# EasyEDA Pro project Lamp Gcse Main Control board V0.3.epro

# Schematic Schematic1_2

## Sheets
1 P1: Board Name: Board2_1; Create Date: 2025-11-16; Page Name: P1; Project Name: GCSE LAMP PCBs; Schematic Name: Schematic1_2; Update Date: 2025-11-16; Company: EasyEDA.com; Page Size: A4; Version: V1.0
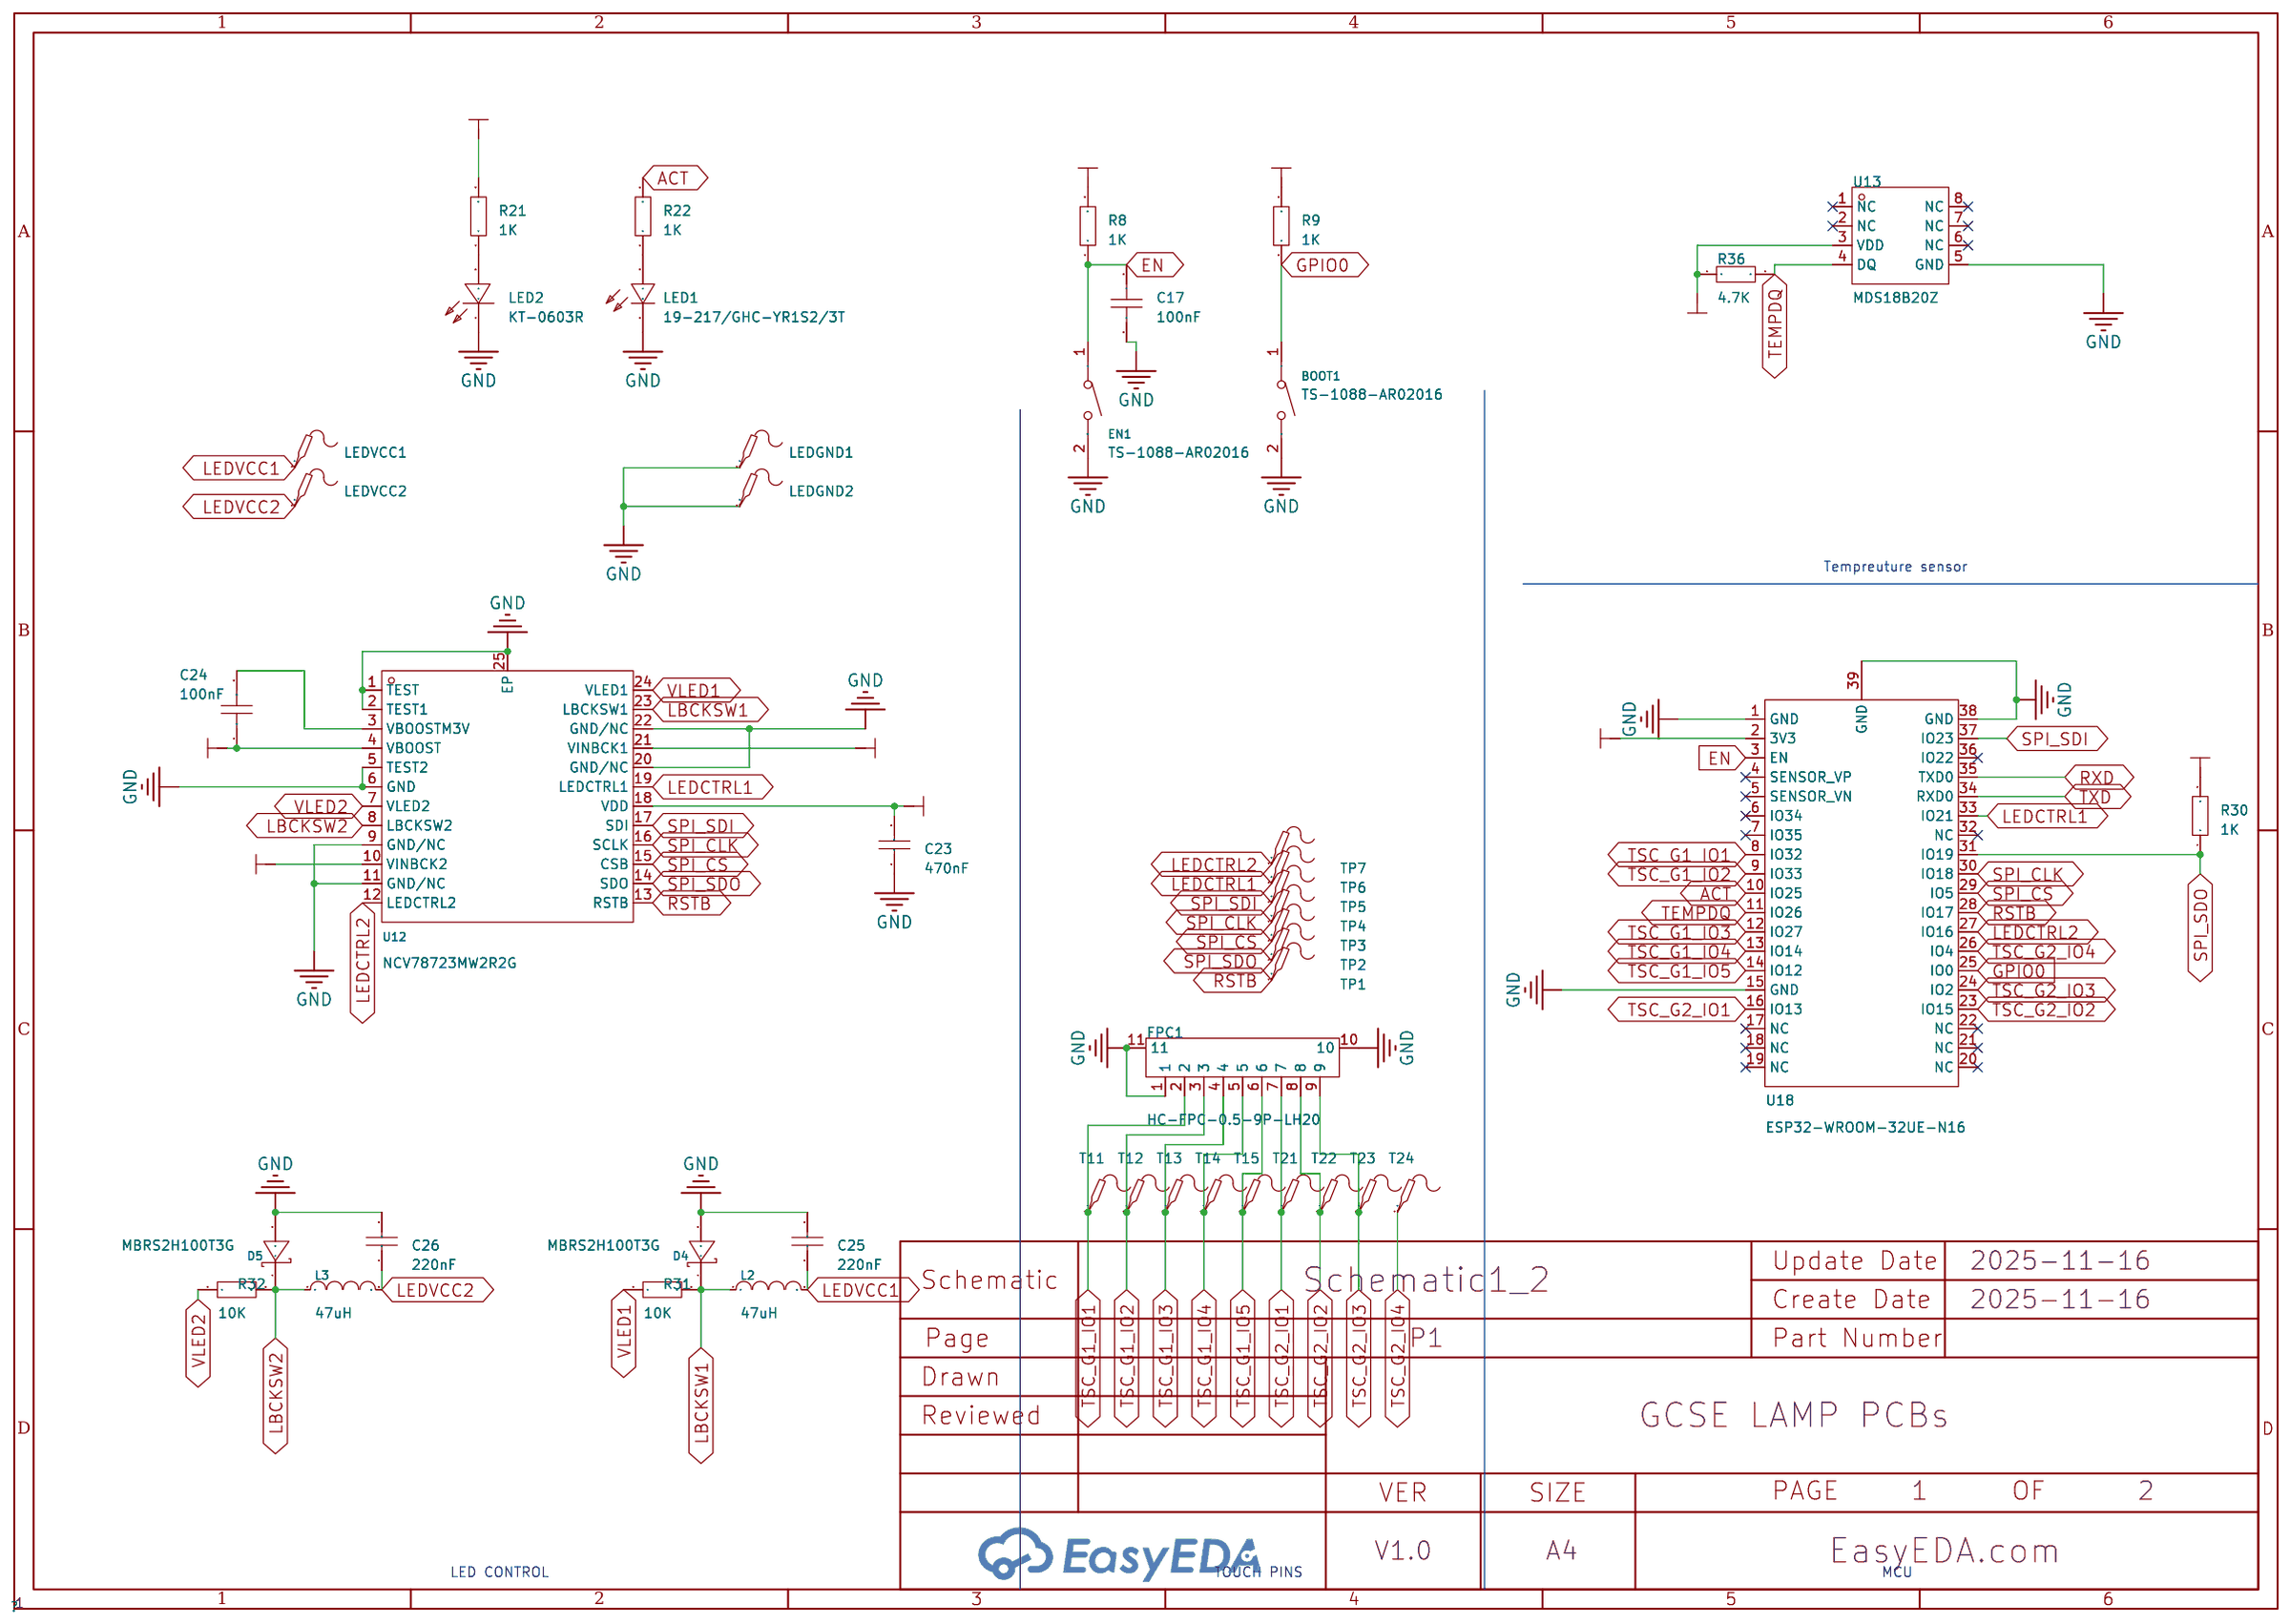
[diagram p0: P1]
2 P2: Page Name: P2; Update Date: 2025-11-18
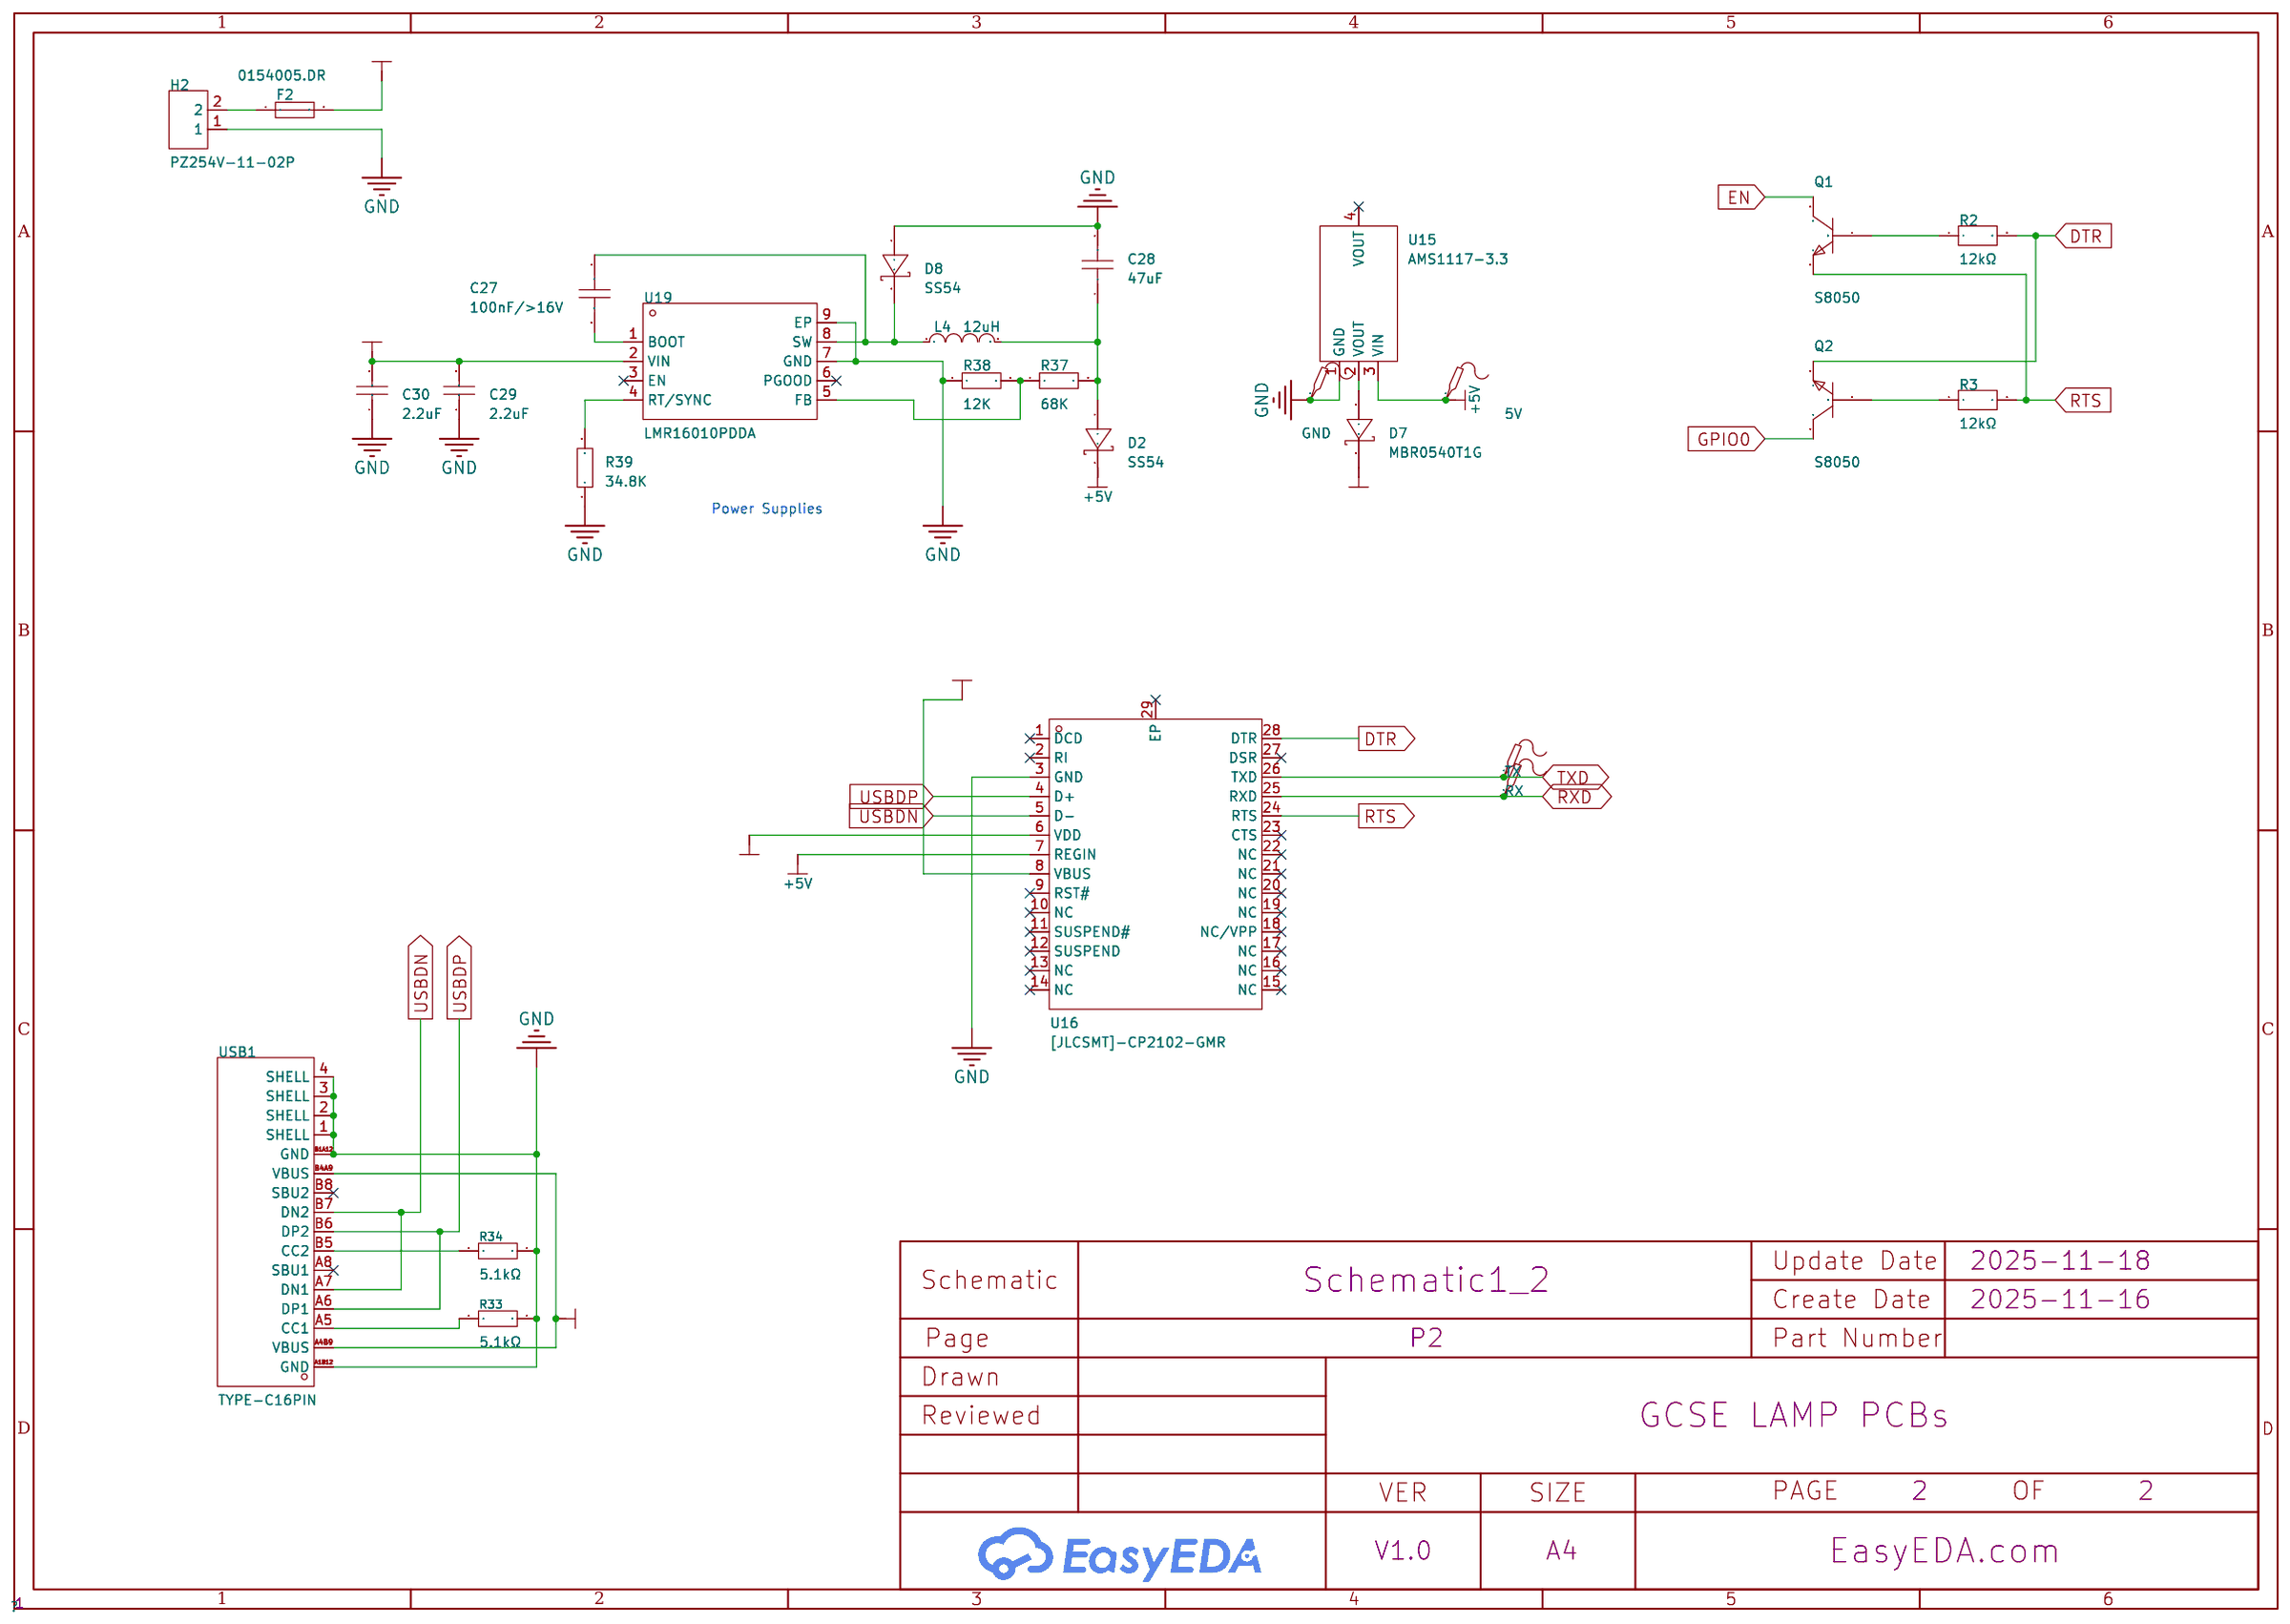
[diagram p1: P2]

## Parts
sheet P1
BOOT1  TS-1088-AR02016  [SW-SMD_L3.9-W3.0-P4.45]
C17  100nF  [C0603]
C23  470nF  [C0603]
C24  100nF  [C0805]
C25  220nF  [C0603]
C26  220nF  [C0603]
D4  MBRS2H100T3G  [SMB_L4.6-W3.6-LS5.3-RD]
D5  MBRS2H100T3G  [SMB_L4.6-W3.6-LS5.3-RD]
EN1  TS-1088-AR02016  [SW-SMD_L3.9-W3.0-P4.45]
FPC1  HC-FPC-0.5-9P-LH20  [FPC-SMD_9P-P0.50_HC-FPC-0.5-9P-LH20]
L2  47uH  [IND-SMD_L11.5-W10.0_SMMS1040]
L3  47uH  [IND-SMD_L11.5-W10.0_SMMS1040]
LED1  19-217/GHC-YR1S2/3T  [LED0603-RD]
LED2  KT-0603R  [LED0603-RD]
LEDGND1  -  [Test-Point-0.5mm]
LEDGND2  -  [Test-Point-0.5mm]
LEDVCC1  -  [Test-Point-0.5mm]
LEDVCC2  -  [Test-Point-0.5mm]
R8  1K  [R0603]
R9  1K  [R0603]
R21  1K  [R0603]
R22  1K  [R0603]
R30  1K  [R0603]
R31  10K  [R0603]
R32  10K  [R0603]
R36  4.7K  [R0603]
T11  -  [Test-Point-0.5mm]
T12  -  [Test-Point-0.5mm]
T13  -  [Test-Point-0.5mm]
T14  -  [Test-Point-0.5mm]
T15  -  [Test-Point-0.5mm]
T21  -  [Test-Point-0.5mm]
T22  -  [Test-Point-0.5mm]
T23  -  [Test-Point-0.5mm]
T24  -  [Test-Point-0.5mm]
TP1  -  [Test-Point-0.5mm]
TP2  -  [Test-Point-0.5mm]
TP3  -  [Test-Point-0.5mm]
TP4  -  [Test-Point-0.5mm]
TP5  -  [Test-Point-0.5mm]
TP6  -  [Test-Point-0.5mm]
TP7  -  [Test-Point-0.5mm]
U12  NCV78723MW2R2G  [QFN-24_L5.0-W5.0-P0.65-TL-EP3.5]
U13  MDS18B20Z  [SOIC-8_L4.9-W3.9-P1.27-LS6.0-BL]
U18  ESP32-WROOM-32UE-N16  [COMM-SMD_ESP32-WROOM-32UE-N16]
sheet P2
5V  -  [Test-Point-0.5mm]
C27  100nF/>16V  [C0603]
C28  47uF  [C1210]
C29  2.2uF  [C1210]
C30  2.2uF  [C1210]
D2  SS54  [SMA_L4.4-W2.8-LS5.4-R-RD]
D7  MBR0540T1G  [SOD-123_L2.8-W1.8-LS3.7-RD]
D8  SS54  [SMA_L4.4-W2.8-LS5.4-R-RD]
F2  0154005.DR  [FUSE-SMD_L9.8-W5.1]
GND  -  [Test-Point-0.5mm]
H2  PZ254V-11-02P  [HDR-TH_2P-P2.54-V-M]
L4  12uH  [IND-SMD_L4.0-W4.0_FNR40XXS]
Q1  S8050  [SOT-23-3_L2.9-W1.3-P1.90-LS2.4-BR]
Q2  S8050  [SOT-23-3_L2.9-W1.3-P1.90-LS2.4-BR]
R2  12kΩ  [R0603]
R3  12kΩ  [R0603]
R33  5.1kΩ  [R0603]
R34  5.1kΩ  [R0603]
R37  68K  [R0603]
R38  12K  [R0603]
R39  34.8K  [R0603]
RX  -  [Test-Point-0.5mm]
TX  -  [Test-Point-0.5mm]
U15  AMS1117-3.3  [SOT-223-3_L6.5-W3.4-P2.30-LS7.0-BR]
U16  [JLCSMT]-CP2102-GMR  [QFN-28_L5.0-W5.0-P0.50-BL-EP3.15]
U19  LMR16010PDDA  [SO-8_L4.9-W3.9-P1.27-LS6.0-BL-EP]
USB1  TYPE-C16PIN  [USB-C-SMD_TYPE-C16PIN]

## Library data of the parts
BOOT1 EN1 = TS-1088-AR02016: Circuit:SPST Actuator Style:Round Button Operating Force:160gf Mounting Style:Brick nogging Switch Length:4mm Switch Width:3mm Switch Height:2mm Strike Gundam:不带 Contact Current:50mA Voltage Rating (DC):12V Insulation Resistance:100MΩ Actuator/Cap Color:B; LCSC Part Name: 4*3*2mm 立贴 轻触开关; Supplier Part: C720477; Manufacturer: XUNPU(讯普); Supplier Footprint: SMD; JLCPCB Part Class: Extended Part; Datasheet: https://atta.szlcsc.com/upload/public/pdf/source/20200810/C720475_60D09DD6C54279ADDB2DC25100F1CC11.pdf; Supplier: LCSC; Circuit: SPST; Actuator Style: Round Button; Operating Force: 160gf; Mounting Style: Brick nogging; Switch Length: 4mm; Switch Width: 3mm; Switch Height: 2mm; Strike Gundam: 不带; Contact Current: 50mA; Voltage Rating (DC): 12V; Insulation Resistance: 100MΩ; Actuator/Cap Color: Black; Pin Style: SMDSplicing; Mechanical Life: 10万次; Operating Temperature: -30℃~+80℃
C17 = GMC10X7R104K50NT: Capacitance:0.1uF Tolerance:±10% Tolerance:±10% Voltage Rating:50V Temperature Coefficient:X7R; LCSC Part Name: 100nF ±10% 50V; Supplier Part: C17669921; Manufacturer: CAL-CHIP; Supplier Footprint: 0603; JLCPCB Part Class: 扩展库; Datasheet: https://atta.szlcsc.com/upload/public/pdf/source/231023/C17227280-d034107a430199d086d7de5e47b32198.pdf; Supplier: LCSC; Tolerance: ±10%; Voltage Rating: 50V; Temperature Coefficient: X7R
C23 = CL10B474KA8NNNC: Capacitance: Tolerance:±10% Tolerance:±10% Voltage Rated: Temperature Coefficient:; LCSC Part Name: 470nF ±10% 25V; Supplier Part: C1623; Manufacturer: SAMSUNG(三星); Supplier Footprint: 0603; JLCPCB Part Class: Basic Part; Datasheet: https://atta.szlcsc.com/upload/public/pdf/source/20160218/1457707763339.pdf; Supplier: LCSC; Tolerance: ±10%
C24 = CC0805KRX7R9BB104: Capacitance: Tolerance:±10% Tolerance:±10% Voltage Rated: Temperature Coefficient:; LCSC Part Name: 100nF ±10% 50V; Supplier Part: C49678; Manufacturer: YAGEO(国巨); Supplier Footprint: 0805; JLCPCB Part Class: 基础库; Datasheet: https://atta.szlcsc.com/upload/public/pdf/source/20180224/C181747_15194369449651363981.pdf; Supplier: LCSC; Tolerance: ±10%
C25 C26 = CL10B224KB8NNNC: Capacitance: Tolerance:±10% Tolerance:±10% Voltage Rated: Temperature Coefficient:; LCSC Part Name: 220nF ±10% 50V; Supplier Part: C64705; Manufacturer: SAMSUNG(三星); Supplier Footprint: 0603; JLCPCB Part Class: Extended Part; Datasheet: https://atta.szlcsc.com/upload/public/pdf/source/20160218/1457707763339.pdf; Supplier: LCSC; Tolerance: ±10%
D4 D5 = MBRS2H100T3G: Forward Voltage (Vf@If):790mV@2A Reverse Voltage (Vr):100V Average Rectified Current (Io):2A Reverse Leakage Current (Ir):8uA@100V; LCSC Part Name: 电压:100V 电流:2A; Supplier Part: C83299; Manufacturer: onsemi(安森美); Supplier Footprint: SMB(DO-214AA); JLCPCB Part Class: 扩展库; Datasheet: https://atta.szlcsc.com/upload/public/pdf/source/20180112/C153778_15157258148341261644.PDF; Supplier: LCSC; Forward Voltage (Vf@If): 790mV@2A; Reverse Voltage (Vr): 100V; Average Rectified Current (Io): 2A; Reverse Leakage Current (Ir): 8uA@100V
FPC1 = HC-FPC-0.5-9P-LH20: Locking Feature:Slide Lock Contact Type:Single-side Contact/Vertical Number of Contacts:9P Pitch:0.5mm Mounting Type:Surface Mount,Vertical FFC, FCB Thickness:0.3mm FFC, FCB Thickness:0.3mm Height Above Board:4.5mm Contact Material:- Contact Plating:- Ope; LCSC Part Name: 抽屉式 单侧触点/垂直 P数:9P 间距:0.5mm; Supplier Part: C49166890; Manufacturer: HC(虹成电子); Supplier Footprint: SMD,P=0.5mm(交错脚); JLCPCB Part Class: Extended Part; Datasheet: https://atta.szlcsc.com/upload/public/pdf/source/20250613/82F48CADE1F9CB45E74CB3AE3886D5BC.pdf; Supplier: LCSC; Locking Feature: Slide Lock; Contact Type: Single-side Contact/Vertical; Number of Contacts: 9P; Pitch: 0.5mm; Mounting Type: Surface Mount,Vertical; FFC, FCB Thickness: 0.3mm; Height Above Board: 4.5mm; Operating Temperature: -25℃~+85℃
L2 L3 = SMMS1040-470M: Inductance: Tolerance:±20% Tolerance:±20% Rated Current: Saturation Current (Isat):4.5A DC Resistance (DCR): Type:一体成型电感; LCSC Part Name: 47uH ±20% 4.5A; Supplier Part: C149599; Manufacturer: SXN(顺翔诺); JLCPCB Part Class: 扩展库; Datasheet: https://atta.szlcsc.com/upload/public/pdf/source/20210810/BBF24330FB2F5029F637830BA9C42C0D.pdf; Supplier: LCSC; Tolerance: ±20%; Saturation Current (Isat): 4.5A; Type: 一体成型电感
LED1 = 19-217/GHC-YR1S2/3T: Illumination Color:Emerald Green Voltage - Forward(Vf):3.3V Voltage - Forward(Vf):3.3V Power(Watts):110mW Forward Current:20mA Wavelength - Dominant:520nm~535nm Wavelength - Dominant:520nm~535nm Peak Wavelength:518nm Diode Configuration:- Lens Color:Water; LCSC Part Name: 翠绿 停产; Supplier Part: C72043; Manufacturer: EVERLIGHT(亿光); Supplier Footprint: 0603; JLCPCB Part Class: Extended Part; Supplier: LCSC; Illumination Color: Emerald Green; Voltage - Forward(Vf): 3.3V; Power(Watts): 110mW; Forward Current: 20mA; Wavelength - Dominant: 520nm~535nm; Peak Wavelength: 518nm; Lens Color: Water Clear; Luminous Intensity: 199mcd; Viewing Angle: 120°; Operating Temperature: -40℃~+85℃
LED2 = KT-0603R: Emitted Color:Red Power Dissipation:- Forward Current:- Dominant Wavelength:- Dominant Wavelength:- Peak Wavelength:- Diode Configuration:- Lens Color:- Color Temperature:- Color Temperature:- Viewing Angle:- Mounting Sytle:- Operating Temperature:-40℃~+8; LCSC Part Name: 0603 红灯 高亮; Supplier Part: C2286; Manufacturer: KENTO; Supplier Footprint: 0603; JLCPCB Part Class: 基础库; Datasheet: https://atta.szlcsc.com/upload/public/pdf/source/20160616/1466072038404.pdf; Supplier: LCSC; Emitted Color: Red; Operating Temperature: -40℃~+85℃
5V GND LEDGND1 LEDGND2 LEDVCC1 LEDVCC2 RX T11-T15 T21-T24 TP1-TP7 TX = Test-Point: Test Point 测试点
R8 R9 R21 R22 R30-R32 R36-R39 = Res_0603: Supplier Footprint: 0603
U12 = NCV78723MW2R2G: Supplier Part: C895782; Manufacturer: onsemi(安森美); Supplier Footprint: QFN-24-EP(5x5); JLCPCB Part Class: 扩展库; Datasheet: https://atta.szlcsc.com/upload/public/pdf/source/20221020/99BF96CD2D5C1BFF80979CF39107DFF8.pdf; Supplier: LCSC
U13 = MDS18B20Z: Supplier Part: C42403144; Manufacturer: MSKSEMI(美森科); Supplier Footprint: SOP-8; Datasheet: https://atta.szlcsc.com/upload/public/pdf/source/20241218/E228AEB1B782468788A84EC190D1A8BD.pdf; Supplier: LCSC
U18 = ESP32-WROOM-32UE-N16_C701346: LCSC Part Name: 通用型Wi-Fi+BT+BLE MCU模组; Supplier Part: C701346; Manufacturer: ESPRESSIF(乐鑫); Supplier Footprint: SMD,18x19.2mm; JLCPCB Part Class: Extended Part; Datasheet: https://atta.szlcsc.com/upload/public/pdf/source/20241030/447B1C85FFE3FB0A37F75624F2C6635F.pdf; Supplier: LCSC
C27 = CAP_0603: Supplier Footprint: 0603
C28 = CS3225X7R476K160NRL: Capacitance:47uF Tolerance:±10% Tolerance:±10% Voltage Rating:16V Temperature Coefficient:X7R; LCSC Part Name: 47uF ±10% 16V; Supplier Part: C5440143; Manufacturer: SAMWHA(三和); Supplier Footprint: 1210; JLCPCB Part Class: Extended Part; Datasheet: https://atta.szlcsc.com/upload/public/pdf/source/20241120/90C342CED6A4517481676783052A38A7.pdf; Supplier: LCSC; Tolerance: ±10%; Voltage Rating: 16V; Temperature Coefficient: X7R
C29 C30 = CL32B225KCJSNNE: Capacitance:2.2uF Tolerance:±10% Tolerance:±10% Voltage Rating:100V Temperature Coefficient:X7R; LCSC Part Name: 2.2uF ±10% 100V; Supplier Part: C55151; Manufacturer: SAMSUNG(三星); Supplier Footprint: 1210; JLCPCB Part Class: 扩展库; Datasheet: https://item.szlcsc.com/datasheet/CL32B225KCJSNNE/56177.html; Supplier: LCSC; Tolerance: ±10%; Voltage Rating: 100V; Temperature Coefficient: X7R
D2 D8 = SS54_C22452: Diode Configuration:Independent Type Forward Voltage (Vf@If):550mV@5A Reverse Voltage (Vr):40V Rectified Current:5A Reverse Leakage Current (Ir):1mA@40V; LCSC Part Name: 电压:40V 电流:5A; Supplier Part: C22452; Manufacturer: MDD(辰达半导体); Supplier Footprint: SMA(DO-214AC); JLCPCB Part Class: 基础库; Datasheet: https://atta.szlcsc.com/upload/public/pdf/source/20240710/73DFBB65C1883B895E62D589679033DF.pdf; Supplier: LCSC; Diode Configuration: Independent Type; Forward Voltage (Vf@If): 550mV@5A; Reverse Voltage (Vr): 40V; Rectified Current: 5A; Reverse Leakage Current (Ir): 1mA@40V
D7 = MBR0540T1G: Forward Voltage (Vf@If):510mV@500mA Reverse Voltage (Vr):40V Average Rectified Current (Io):500mA Reverse Leakage Current (Ir):20uA@40V; LCSC Part Name: 电压:40V 电流:500mA; Supplier Part: C21353; Manufacturer: onsemi(安森美); Supplier Footprint: SOD-123; Datasheet: https://atta.szlcsc.com/upload/public/pdf/source/20181113/C328095_0ADB589A6C59DC8F2F7039A680300F42.pdf; Supplier: LCSC; Forward Voltage (Vf@If): 510mV@500mA; Reverse Voltage (Vr): 40V; Average Rectified Current (Io): 500mA; Reverse Leakage Current (Ir): 20uA@40V
F2 = 0154005.DR: Type:SMD Fuse（with Holder） Current Rating:5A Voltage Rating  (AC):125V Voltage Rating (DC):125V Operating Temperature:-55℃~+125℃ Operating Temperature:-55℃~+125℃ Breaking Capacity:50A; LCSC Part Name: 125V贴片式保险丝（含保险丝座）; Supplier Part: C206916; Manufacturer: Littelfuse(美国力特); Supplier Footprint: SMD,9.7x5mm; JLCPCB Part Class: Extended Part; Datasheet: https://atta.szlcsc.com/upload/public/pdf/source/20181031/C315847_D8C8759CD5ED576C0EA975A2D5312378.pdf; Supplier: LCSC; Type: SMD Fuse（with Holder）; Current Rating: 5A; Voltage Rating  (AC): 125V; Voltage Rating (DC): 125V; Operating Temperature: -55℃~+125℃; Breaking Capacity: 50A
H2 = PZ254V-11-02P: Pin Structure:1x2P Pitch:2.54mm Row Spacing:- Circluar Pins/Square Pins:Policy Mounting Type:Straight Number of Rows:Single Row Number of Pins:2P Current Rating:- Voltage Rating (Max):- Length of Mating Pin:6mm Insulation Height:2.5mm Length of End Connec; LCSC Part Name: 1x2P 间距:2.54mm 方针 直插; Supplier Part: C492401; Manufacturer: XFCN(兴飞); Supplier Footprint: 插件,P=2.54mm; JLCPCB Part Class: 扩展库; Datasheet: https://atta.szlcsc.com/upload/public/pdf/source/20200309/C492401_A812433581A9B211A7FFA413ADDFF0E5.pdf; Supplier: LCSC; Pin Structure: 1x2P; Pitch: 2.54mm; Circluar Pins/Square Pins: Policy; Mounting Type: Straight; Number of Rows: Single Row; Number of Pins: 2P; Length of Mating Pin: 6mm; Insulation Height: 2.5mm; Length of End Connection Pin: 3mm; Contact Material: Brass; Operating Temperature: -40℃~+105℃; Color: Black
L4 = FNR4030S120MT: Inductance:12uH Tolerance:±20% Tolerance:±20% Current Rating:1.4A Current - Saturation(Isat):1.8A DC Resistance(DCR):175mΩ Type:Magnetic Core Shielded Winding Alloy Inductor; LCSC Part Name: 12uH ±20% 1.8A; Supplier Part: C167880; Manufacturer: cjiang(长江微电); Supplier Footprint: SMD,4x4mm; JLCPCB Part Class: Extended Part; Datasheet: https://atta.szlcsc.com/upload/public/pdf/source/20190327/C167925_9EFF0AABC4CA629C2CC95961DBF7D39D.pdf; Supplier: LCSC; Tolerance: ±20%; Current Rating: 1.4A; Current - Saturation(Isat): 1.8A; DC Resistance(DCR): 175mΩ; Type: Magnetic Core Shielded Winding Alloy Inductor
Q1 Q2 = S8050: Transistor Type: Collector Current (Ic): Collector-Emitter Breakdown Voltage (Vceo): Power Dissipation (Pd):; LCSC Part Name: 耐压:25V 电流:500mA NPN; Supplier Part: C139514; Supplier Footprint: SOT-23; JLCPCB Part Class: Extended Part; Datasheet: https://atta.szlcsc.com/upload/public/pdf/source/20171116/C139514_15108221321741123744.pdf; Supplier: LCSC
R2 R3 = RT0805BRE0712KL: Type:Thin Film Resistor Resistance: Tolerance:±0.1% Tolerance:±0.1% Power(Watts): Overload Voltage (Max): Temperature Coefficient:±50ppm/℃ Temperature Coefficient:±50ppm/℃ Operating Temperature Range:-55℃~+155℃ Operating Temperature Range:-55℃~+155℃; LCSC Part Name: 薄膜电阻 12kΩ ±0.1% 125mW; Supplier Part: C706254; Manufacturer: YAGEO(国巨); Supplier Footprint: 0805; JLCPCB Part Class: Extended Part; Datasheet: https://atta.szlcsc.com/upload/public/pdf/source/20200720/C706254_48CF9B2495B4DE73A06681258C685E55.pdf; Supplier: LCSC; Type: Thin Film Resistor; Tolerance: ±0.1%; Temperature Coefficient: ±50ppm/℃; Operating Temperature Range: -55℃~+155℃
R33 R34 = RMC08055.1K1%N: Resistance: Tolerance:±1% Tolerance:±1% Power(Watts):; LCSC Part Name: 5.1kΩ ±1% 125mW; Supplier Part: C269748; Manufacturer: Tyohm(幸亚电阻); Supplier Footprint: 0805; Datasheet: https://atta.szlcsc.com/upload/public/pdf/source/20190115/C325956_D27151D492FFB3C9AB4A6F14FE01F30A.pdf; Supplier: LCSC; Tolerance: ±1%
U15 = AMS1117-3.3_C6186: Output Type:Fixed Voltage - Supply:16V Output Voltage:3.3V Output Voltage:3.3V Output Current:1A Power Supply Rejection Ratio (PSRR):72dB@(120Hz) Voltage Dropout:1.1V@(800mA) standby current:5mA Noise:- Features:Over Current Protection；Over Temperature Pr; LCSC Part Name: 输出3.3V 1A; Supplier Part: C6186; Manufacturer: AMS; Supplier Footprint: SOT-223; JLCPCB Part Class: Basic Part; Datasheet: https://atta.szlcsc.com/upload/public/pdf/source/20180727/C6186_7A095716F0823C02F1997A905E26C086.pdf; Supplier: LCSC; Output Type: Fixed; Voltage - Supply: 16V; Output Voltage: 3.3V; Output Current: 1A; Power Supply Rejection Ratio (PSRR): 72dB@(120Hz); Voltage Dropout: 1.1V@(800mA); standby current: 5mA; Features: Over Current Protection；Over Temperature Protection; Operating Temperature: -40℃~+125℃; Output Configuration: Positive; Number of Outputs: 1
U16 = [JLCSMT]-CP2102-GMR: Supplier Part: C2803352; Supplier Footprint: QFN-28-EP(5x5); Supplier: LCSC
U19 = LMR16010PDDA: Function:Buck Voltage - Supply:4.3V~60V Voltage - Supply:4.3V~60V Output Voltage:800mV~50V Output Voltage:800mV~50V Output Current:1A Frequency - Switching:2.5MHz Frequency - Switching:2.5MHz Operating Temperature:-40℃~+125℃@(TJ) Operating Temperature:-40; LCSC Part Name: 60V、1A降压转换器; Supplier Part: C1355364; Manufacturer: TI(德州仪器); Supplier Footprint: SO-8-EP; JLCPCB Part Class: 扩展库; Datasheet: https://www.ti.com/cn/lit/gpn/lmr16010; Supplier: LCSC; Function: Buck; Voltage - Supply: 4.3V~60V; Output Voltage: 800mV~50V; Output Current: 1A; Frequency - Switching: 2.5MHz; Operating Temperature: -40℃~+125℃@(TJ); Synchronous Rectifier: No; Number of Outputs: 1; Topology: Buck; Quiescent Current: 40uA; Switch tube (built-in/external): Built-In; Output Type: Adjustable
USB1 = TYPE-C16PIN: Connector Type:Type-C Standard:USB 3.1 Gender:Female Mounting Style:Horizontal attachment Number of Contacts:16P Number of Ports:1 Current Rating - Power (Max):3A Operating Temperature Range:-40℃~+85℃ Operating Temperature Range:-40℃~+85℃ Rated Voltage (M; LCSC Part Name: Type-C 母 卧贴; Supplier Part: C393939; Manufacturer: SHOU HAN(首韩); Supplier Footprint: SMD; JLCPCB Part Class: 扩展库; Datasheet: https://atta.szlcsc.com/upload/public/pdf/source/20190521/C393939_7B9043D4CF1026AF443AB60D91FBCD5C.pdf; Supplier: LCSC; Connector Type: Type-C; Standard: USB 3.1; Gender: Female; Mounting Style: Horizontal attachment; Number of Contacts: 16P; Number of Ports: 1; Current Rating - Power (Max): 3A; Operating Temperature Range: -40℃~+85℃; Rated Voltage (Max): 30V; Connect-Disconnect Life: 10,000 times; Core Colour: Black

## Nets
24VIN: C24.1 C29.2 C30.2 F2.2 U12.4(VBOOST) U12.10(VINBCK2) U12.21(VINBCK1) U19.2(VIN)
+3.3V: C23.2 D7.1(K) R8.2 R9.2 R21.2 R30.2 R36.1 U12.18(VDD) U13.3(VDD) U16.6(VDD) U18.2(3V3)
+5V: 5V.1 D2.2(K) U15.3(VIN) U16.7(REGIN) U16.8(VBUS) USB1.A4B9(VBUS) USB1.B4A9(VBUS)
GND: BOOT1.2 C17.2 C23.1 C25.2 C26.2 C28.2 C29.1 C30.1 D4.2(A) D5.2(A) D8.1(A) EN1.2 FPC1.1 FPC1.10 FPC1.11 GND.1 H2.1 LED1.1(C) LED2.1(K) LEDGND1.1 LEDGND2.1 R33.1 R34.1 R38.1 R39.1 U12.1(TEST) U12.2(TEST1) U12.5(TEST2) U12.6(GND) U12.9(GND/NC) U12.11(GND/NC) U12.20(GND/NC) U12.22(GND/NC) U12.25(EP) U13.5(GND) U15.1(GND) U16.3(GND) U18.1(GND) U18.15(GND) U18.38(GND) U18.39(GND) U19.7(GND) U19.9(EP) USB1.1(SHELL) USB1.2(SHELL) USB1.3(SHELL) USB1.4(SHELL) USB1.A1B12(GND) USB1.B1A12(GND)
ACT: R22.2 U18.10(IO25)
DTR: Q2.2(E) R2.2 U16.28(DTR)
EN: C17.1 EN1.1 Q1.3(C) R8.1 U18.3(EN)
GPIO0: BOOT1.1 Q2.3(C) R9.1 U18.25(IO0)
LBCKSW1: D4.1(K) L2.1 R31.2 U12.23(LBCKSW1)
LBCKSW2: D5.1(K) L3.1 R32.2 U12.8(LBCKSW2)
LEDCTRL1: TP6.1 U12.19(LEDCTRL1) U18.33(IO21)
LEDCTRL2: TP7.1 U12.12(LEDCTRL2) U18.27(IO16)
LEDVCC1: C25.1 L2.2 LEDVCC1.1
LEDVCC2: C26.1 L3.2 LEDVCC2.1
RSTB: TP1.1 U12.13(RSTB) U18.28(IO17)
RTS: Q1.2(E) R3.2 U16.24(RTS)
RXD: RX.1 U16.25(RXD) U18.35(TXD0)
SPI_CLK: TP4.1 U12.16(SCLK) U18.30(IO18)
SPI_CS: TP3.1 U12.15(CSB) U18.29(IO5)
SPI_SDI: TP5.1 U12.17(SDI) U18.37(IO23)
SPI_SDO: R30.1 TP2.1 U12.14(SDO) U18.31(IO19)
TEMPDQ: R36.2 U13.4(DQ) U18.11(IO26)
TSC_G1_IO1: FPC1.2 T11.1 U18.8(IO32)
TSC_G1_IO2: FPC1.3 T12.1 U18.9(IO33)
TSC_G1_IO3: FPC1.4 T13.1 U18.12(IO27)
TSC_G1_IO4: FPC1.5 T14.1 U18.13(IO14)
TSC_G1_IO5: FPC1.6 T15.1 U18.14(IO12)
TSC_G2_IO1: FPC1.7 T21.1 U18.16(IO13)
TSC_G2_IO2: FPC1.8 T22.1 U18.23(IO15)
TSC_G2_IO3: FPC1.9 T23.1 U18.24(IO2)
TSC_G2_IO4: T24.1 U18.26(IO4)
TXD: TX.1 U16.26(TXD) U18.34(RXD0)
USBDN: U16.5(D-) USB1.A7(DN1) USB1.B7(DN2)
USBDP: U16.4(D+) USB1.A6(DP1) USB1.B6(DP2)
VLED1: R31.1 U12.24(VLED1)
VLED2: R32.1 U12.7(VLED2)
$1N7319: C24.2 U12.3(VBOOSTM3V)
$2N873: D7.2(A) U15.2(VOUT)
$2N891: F2.1 H2.2
$2N1118: Q1.1(B) R2.1
$2N1121: Q2.1(B) R3.1
$2N1251: R33.2 USB1.A5(CC1)
$2N1380: R34.2 USB1.B5(CC2)
$2N4816: C27.2 U19.1(BOOT)
$2N5057: R37.1 R38.2 U19.5(FB)
$2N5135: R39.2 U19.4(RT/SYNC)
$2N5231: C28.1 D2.1(A) L4.2 R37.2
$2N5237: C27.1 D8.2(K) L4.1 U19.8(SW)
Net-(LED1-2): LED1.2(A) R22.1
Net-(LED2-2): LED2.2(A) R21.1

Not connected (* = marked no-connect by the designer): U13 1(NC)* 2(NC)* 6(NC)* 7(NC)* 8(NC)*; U15 4(VOUT)*; U16 1(DCD)* 2(RI)* 9(RST#)* 10(NC)* 11(SUSPEND#)* 12(SUSPEND)* 13(NC)* 14(NC)* 15(NC)* 16(NC)* 17(NC)* 18(NC/VPP)* 19(NC)* 20(NC)* 21(NC)* 22(NC)* 23(CTS)* 27(DSR)* 29(EP)*; U18 4(SENSOR_VP)* 5(SENSOR_VN)* 6(IO34)* 7(IO35)* 17(NC)* 18(NC)* 19(NC)* 20(NC)* 21(NC)* 22(NC)* 32(NC)* 36(IO22)*; U19 3(EN)* 6(PGOOD)*; USB1 A8(SBU1)* B8(SBU2)*

## Notes on the sheets
sheet 1
- Tempreuture sensor
- LED CONTROL
- TOUCH PINS
- MCU
sheet 2
- Power Supplies

# Board PCB3_1
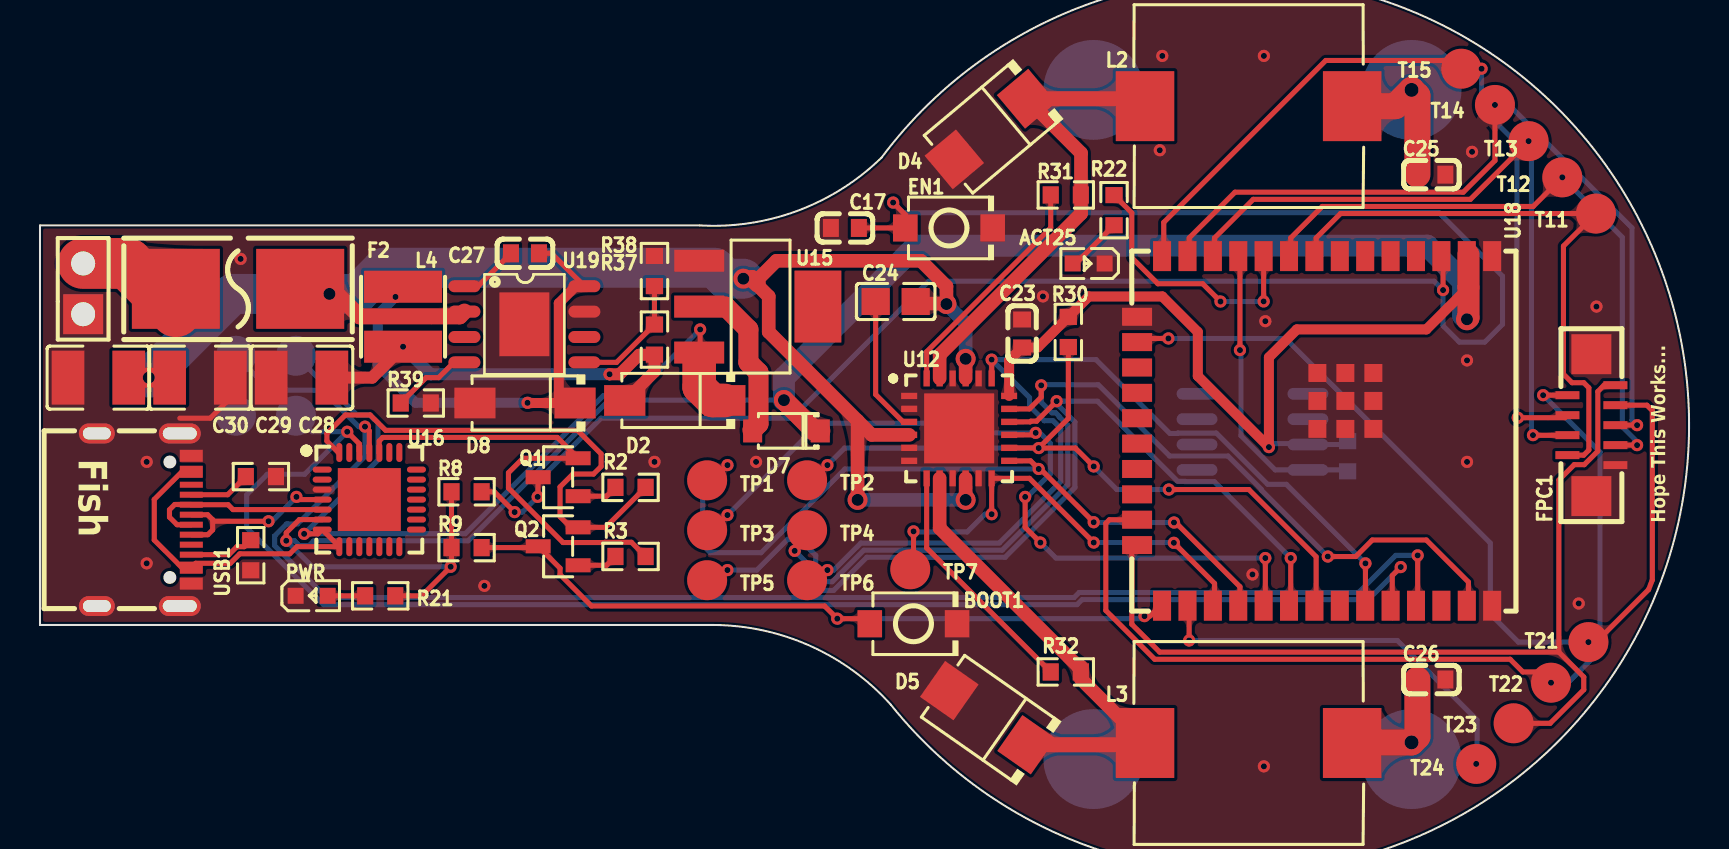
[diagram p2: board, top side]
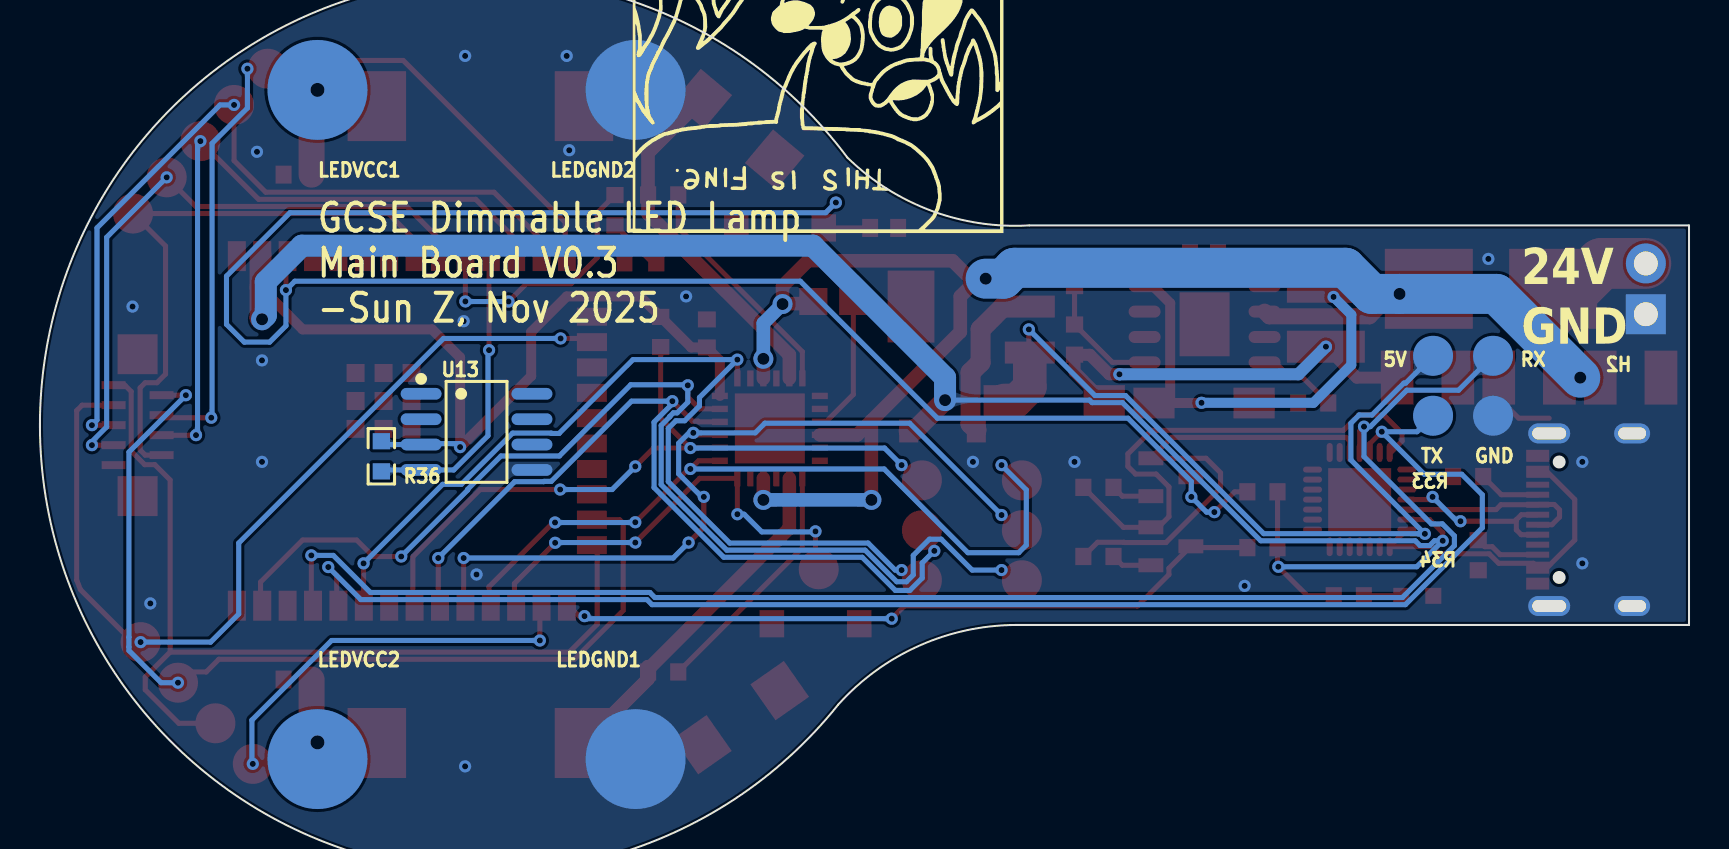
[diagram p3: board, bottom side, seen from below]

Outline 82.48 x 44.83 mm; copper layers: Top Layer, Bottom Layer. Coordinates in mm from the lower left corner of the outline.
Outline path: 0,32.42 33,32.42 arc(37.91,33.15) 42.1,35.81 arc(82.48,22.8) 42.56,8.42 arc(38.56,11.35) 33.71,12.42 0,12.42 0,32.42
Stack: Top Layer 0.035mm / Dielectric1 1.51mm FR4 er 4.5 / Bottom Layer 0.035mm

## Design rules (mm)
template: Custom Config
spacing copperThickness1oz (default): track to track 0.102, other pairs 0.152 to 0.3
spacing copperThickness2oz: track to track 0.203, other pairs 0.152 to 0.3
track width copperThickness1oz (default): min 0.127, default 0.254, max 2.54
track width copperThickness2oz: min 0.203, default 0.254, max 2.54
differential pair differentialPair (default): width min 0.127, default 0.254, max 2.54; gap min 0.152, default 0.152
via viaSize (default): diameter min 0.5, default 0.61, max 10; hole min 0.3, default 0.305, max 6.3

## Placement (name value [footprint] x y rotation side)
5V  -  [Test-Point-0.5mm]  12.8 25.89 0 bottom
ACT25  19-217/GHC-YR1S2/3T  [LED0603-RD]  52.45 30.51 180 top
BOOT1  TS-1088-AR02016  [SW-SMD_L3.9-W3.0-P4.45]  43.69 12.48 0 top
C17  100nF  [C0603]  40.26 32.29 180 top
C23  470nF  [C0603]  49.12 27.01 270 top
C24  100nF  [C0805]  42.8 28.61 180 top
C25  220nF  [C0603]  69.6 34.96 0 top
C26  220nF  [C0603]  69.6 9.68 0 top
C27  100nF/>16V  [C0603]  24.26 31.02 180 top
C28  47uF  [C1210]  13.08 24.8 180 top
C29  2.2uF  [C1210]  8 24.8 180 top
C30  2.2uF  [C1210]  2.92 24.8 0 top
D2  SS54  [SMA_L4.4-W2.8-LS5.4-R-RD]  31.75 23.65 180 top
D4  MBRS2H100T3G  [SMB_L4.6-W3.6-LS5.3-RD]  47.54 37.24 220 top
D5  MBRS2H100T3G  [SMB_L4.6-W3.6-LS5.3-RD]  47.41 7.77 145 top
D7  MBR0540T1G  [SOD-123_L2.8-W1.8-LS3.7-RD]  37.34 22.13 180 top
D8  SS54  [SMA_L4.4-W2.8-LS5.4-R-RD]  24.26 23.53 180 top
EN1  TS-1088-AR02016  [SW-SMD_L3.9-W3.0-P4.45]  45.47 32.29 0 top
F2  0154005.DR  [FUSE-SMD_L9.8-W5.1]  9.91 29.24 0 top
FPC1  HC-FPC-0.5-9P-LH20  [FPC-SMD_9P-P0.50_HC-FPC-0.5-9P-LH20]  77.6 22.42 90 top
GND  -  [Test-Point-0.5mm]  9.8 22.89 0 bottom
H2  PZ254V-11-02P  [HDR-TH_2P-P2.54-V-M]  2.16 29.24 90 top
L2  47uH  [IND-SMD_L11.5-W10.0_SMMS1040]  60.45 38.38 0 top
L3  47uH  [IND-SMD_L11.5-W10.0_SMMS1040]  60.45 6.51 0 top
L4  12uH  [IND-SMD_L4.0-W4.0_FNR40XXS]  18.16 27.84 270 top
LEDGND1  -  [Test-Point-0.5mm#2]  52.69 5.7 0 bottom
LEDGND2  -  [Test-Point-0.5mm#2]  52.69 39.2 0 bottom
LEDVCC1  -  [Test-Point-0.5mm#2]  68.6 39.2 0 bottom
LEDVCC2  -  [Test-Point-0.5mm#2]  68.6 5.7 0 bottom
PWR  KT-0603R  [LED0603-RD]  13.59 13.87 0 top
Q1  S8050  [SOT-23-3_L2.9-W1.3-P1.90-LS2.4-BR]  25.92 19.81 0 top
Q2  S8050  [SOT-23-3_L2.9-W1.3-P1.90-LS2.4-BR]  25.92 16.35 0 top
R2  12kΩ  [R0603]  29.54 19.3 0 top
R3  12kΩ  [R0603]  29.54 15.84 0 top
R8  1K  [R0603]  21.34 19.08 180 top
R9  1K  [R0603]  21.34 16.29 180 top
R21  1K  [R0603]  17.02 13.87 0 top
R22  1K  [R0603]  53.72 33.18 90 top
R30  1K  [R0603]  51.44 27.08 90 top
R31  10K  [R0603]  51.31 33.94 0 top
R32  10K  [R0603]  51.31 10.06 0 top
R33  5.1kΩ  [R0603]  11.05 19.84 180 top
R34  5.1kΩ  [R0603]  10.54 15.91 90 top
R36  4.7K  [R0603]  65.41 20.86 270 bottom
R37  68K  [R0603]  30.73 26.7 270 top
R38  12K  [R0603]  30.73 30.13 270 top
R39  34.8K  [R0603]  18.8 23.53 180 top
RX  -  [Test-Point-0.5mm]  9.8 25.89 0 bottom
T11  -  [Test-Point-0.5mm]  77.83 33.01 180 top
T12  -  [Test-Point-0.5mm]  76.14 34.82 180 top
T13  -  [Test-Point-0.5mm]  74.46 36.63 180 top
T14  -  [Test-Point-0.5mm]  72.77 38.44 180 top
T15  -  [Test-Point-0.5mm]  71.09 40.26 0 top
T21  -  [Test-Point-0.5mm]  77.45 11.56 270 top
T22  -  [Test-Point-0.5mm]  75.58 9.53 270 top
T23  -  [Test-Point-0.5mm]  73.71 7.49 270 top
T24  -  [Test-Point-0.5mm]  71.84 5.46 270 top
TP1  -  [Test-Point-0.5mm]  33.37 19.65 0 top
TP2  -  [Test-Point-0.5mm]  38.37 19.65 0 top
TP3  -  [Test-Point-0.5mm]  33.37 17.15 0 top
TP4  -  [Test-Point-0.5mm]  38.37 17.15 0 top
TP5  -  [Test-Point-0.5mm]  33.37 14.65 0 top
TP6  -  [Test-Point-0.5mm]  38.37 14.65 0 top
TP7  -  [Test-Point-0.5mm]  43.53 15.2 0 top
TX  -  [Test-Point-0.5mm]  12.8 22.89 0 bottom
U12  NCV78723MW2R2G  [QFN-24_L5.0-W5.0-P0.65-TL-EP3.5]  45.97 22.26 270 top
U13  MDS18B20Z  [SOIC-8_L4.9-W3.9-P1.27-LS6.0-BL]  60.65 22.08 270 bottom
U15  AMS1117-3.3  [SOT-223-3_L6.5-W3.4-P2.30-LS7.0-BR]  35.94 28.35 180 top
U16  [JLCSMT]-CP2102-GMR  [QFN-28_L5.0-W5.0-P0.50-BL-EP3.15]  16.47 18.69 270 top
U18  ESP32-WROOM-32UE-N16  [COMM-SMD_ESP32-WROOM-32UE-N16]  63.75 22.13 270 top
U19  LMR16010PDDA  [SO-8_L4.9-W3.9-P1.27-LS6.0-BL-EP]  24.23 27.47 270 top
USB1  TYPE-C16PIN  [USB-C-SMD_TYPE-C16PIN]  5.21 17.68 270 top

## Footprints (pads in the part's own frame, mm; a bottom-side part is the same pattern mirrored in y, then rotated)
C0603
  rect 0.8x0.9 smd: 1(-0.7,0) 2(0.7,0)
C0805
  rect 1.41x1.35 smd: 1(-1,0) 2(1,0)
C1210
  rect 1.635x2.7 smd: 1(-1.518,0) 2(1.518,0)
COMM-SMD_ESP32-WROOM-32UE-N16
  rect 1.5x0.9 smd: 1(-8.75,8.88) 2(-8.75,7.61) 3(-8.75,6.34) 4(-8.75,5.07) 5(-8.75,3.8) 6(-8.75,2.53) 7(-8.75,1.26) 8(-8.75,-0.01) 9(-8.75,-1.28) 10(-8.75,-2.55) 11(-8.75,-3.82) 12(-8.75,-5.09) 13(-8.75,-6.36) 14(-8.75,-7.63) 25(8.75,-7.63) 26(8.75,-6.36) 27(8.75,-5.09) 28(8.75,-3.82) 29(8.75,-2.55) 30(8.75,-1.28) 31(8.75,-0.01) 32(8.75,1.26) 33(8.75,2.53) 34(8.75,3.8) 35(8.75,5.07) 36(8.75,6.34) 37(8.75,7.61) 38(8.75,8.88)
  rect 0.9x1.5 smd: 15(-5.715,-8.88) 16(-4.445,-8.88) 17(-3.175,-8.88) 18(-1.905,-8.88) 19(-0.635,-8.88) 20(0.635,-8.88) 21(1.905,-8.88) 22(3.175,-8.88) 23(4.445,-8.88) 24(5.715,-8.88)
  rect 0.9x0.9 smd: 39(-2.9,2.939) 39(-2.9,1.54) 39(-2.9,0.14) 39(-1.5,2.939) 39(-1.5,1.54) 39(-1.5,0.14) 39(-0.1,2.939) 39(-0.1,1.54) 39(-0.1,0.14)
FPC-SMD_9P-P0.50_HC-FPC-0.5-9P-LH20
  rect 0.4x1.2 smd: 1(-2,-1.2) 2(-1.5,1.2) 3(-1,-1.2) 4(-0.5,1.2) 5(0,-1.2) 6(0.5,1.2) 7(1,-1.2) 8(1.5,1.2) 9(2,-1.2)
  rect 2x2 smd: 10(3.55,0) 11(-3.55,0)
FUSE-SMD_L9.8-W5.1
  rect 4.4x4 smd: 1(-3.11,0) 2(3.11,0)
HDR-TH_2P-P2.54-V-M
  rect 2x2 hole 1.2: 1(-1.27,0)
  round 2 hole 1.2: 2(1.27,0)
IND-SMD_L4.0-W4.0_FNR40XXS
  rect 1.6x3.9 smd: 1(-1.5,0) 2(1.5,0)
IND-SMD_L11.5-W10.0_SMMS1040
  rect 2.924x3.5 smd: 1(-5.181,0) 2(5.181,0)
LED0603-RD
  rect 0.8x0.8 smd: 1(-0.799,0) 2(0.799,0)
QFN-24_L5.0-W5.0-P0.65-TL-EP3.5
  rect 0.318x0.8 smd: 1(-1.625,-2.5) 2(-0.975,-2.5) 3(-0.325,-2.5) 4(0.325,-2.5) 5(0.975,-2.5) 6(1.625,-2.5) 13(1.625,2.5) 14(0.975,2.5) 15(0.325,2.5) 16(-0.325,2.5) 17(-0.975,2.5) 18(-1.625,2.5)
  rect 0.8x0.318 smd: 7(2.5,-1.625) 8(2.5,-0.975) 9(2.5,-0.325) 10(2.5,0.325) 11(2.5,0.975) 12(2.5,1.625) 19(-2.5,1.625) 20(-2.5,0.975) 21(-2.5,0.325) 22(-2.5,-0.325) 23(-2.5,-0.975) 24(-2.5,-1.625)
  rect 3.5x3.5 smd: 25(0,0)
QFN-28_L5.0-W5.0-P0.50-BL-EP3.15
  oval 0.3x0.95 smd: 1(-1.502,-2.357) 2(-1.001,-2.357) 3(-0.5,-2.357) 4(0,-2.357) 5(0.5,-2.357) 6(1,-2.357) 7(1.501,-2.357) 15(1.501,2.357) 16(1,2.357) 17(0.5,2.357) 18(0,2.357) 19(-0.5,2.357) 20(-1.001,2.357) 21(-1.502,2.357)
  oval 0.95x0.3 smd: 8(2.357,-1.502) 9(2.357,-1.001) 10(2.357,-0.5) 11(2.357,0) 12(2.357,0.5) 13(2.357,1) 14(2.357,1.501) 22(-2.357,1.501) 23(-2.357,1) 24(-2.357,0.5) 25(-2.357,0) 26(-2.357,-0.5) 27(-2.357,-1.001) 28(-2.357,-1.502)
  rect 3.15x3.15 smd: 29(0,0)
R0603
  rect 0.806x0.864 smd: 1(-0.753,0) 2(0.753,0)
SMA_L4.4-W2.8-LS5.4-R-RD
  rect 2.062x1.539 smd: 1(2.503,0) 2(-2.503,0)
SMB_L4.6-W3.6-LS5.3-RD
  rect 2.047x2.192 smd: 1(-2.361,0) 2(2.361,0)
SO-8_L4.9-W3.9-P1.27-LS6.0-BL-EP
  oval 0.6x1.6 smd: 1(-1.905,-3) 2(-0.635,-3) 3(0.635,-3) 4(1.905,-3) 5(1.905,3) 6(0.635,3) 7(-0.635,3) 8(-1.905,3)
  rect 3.2x2.5 smd: 9(0,0)
SOD-123_L2.8-W1.8-LS3.7-RD
  rect 0.95x1.15 smd: 1(-1.692,0) 2(1.692,0)
SOIC-8_L4.9-W3.9-P1.27-LS6.0-BL
  oval 0.588x2.045 smd: 1(-1.905,-2.772) 2(-0.635,-2.772) 3(0.635,-2.772) 4(1.905,-2.772) 5(1.905,2.772) 6(0.635,2.772) 7(-0.635,2.772) 8(-1.905,2.772)
SOT-23-3_L2.9-W1.3-P1.90-LS2.4-BR
  rect 1.25x0.7 smd: 1(1,-0.95) 2(1,0.95) 3(-1,0)
SOT-223-3_L6.5-W3.4-P2.30-LS7.0-BR
  rect 2.5x1.1 smd: 1(2.97,-2.3) 2(2.97,0) 3(2.97,2.3)
  rect 2.34x3.6 smd: 4(-2.97,0)
SW-SMD_L3.9-W3.0-P4.45
  rect 1.23x1.36 smd: 1(-2.185,0) 2(2.185,0)
Test-Point-0.5mm
  round 2 smd: 1(0,0)
Test-Point-0.5mm#2
  round 5 smd: 1(0,0)
USB-C-SMD_TYPE-C16PIN
  oval 1x2.1 hole 0.6x1.7: 1(-4.32,1.788) 2(4.32,1.788)
  oval 1x1.8 hole 0.6x1.4: 3(-4.32,-2.362) 4(4.32,-2.362)
  rect 0.6x1.15 smd: A1B12(-3.2,2.362) A4B9(-2.4,2.362) B1A12(3.2,2.362) B4A9(2.4,2.362)
  rect 0.3x1.15 smd: A5(-1.25,2.362) A6(-0.25,2.362) A7(0.25,2.362) A8(1.25,2.362) B5(1.75,2.362) B6(0.75,2.362) B7(-0.75,2.362) B8(-1.75,2.362)

## Nets
As in the schematic, except:
GND: ACT25.1 BOOT1.2 C17.2 C23.1 C25.2 C26.2 C28.2 C29.1 C30.1 D4.2 D5.2 D8.1 EN1.2 FPC1.1 FPC1.10 FPC1.11 GND.1 H2.1 LEDGND1.1 LEDGND2.1 PWR.1 R33.1 R34.1 R38.1 R39.1 U12.1 U12.2 U12.5 U12.6 U12.9 U12.11 U12.20 U12.22 U12.25 U13.5 U15.1 U16.3 U18.1 U18.15 U18.38 U18.39 U19.7 U19.9 USB1.1 USB1.2 USB1.3 USB1.4 USB1.A1B12 USB1.B1A12
$1N22135: ACT25.2 R22.1
$1N22137: PWR.2 R21.1

Pads without a net: U13 1 2 6 7 8; U15 4; U16 1 2 9 10 11 12 13 14 15 16 17 18 19 20 21 22 23 27 29; U18 4 5 6 7 17 18 19 20 21 22 32 36; U19 3 6; USB1 A8 B8

## Via types
v1: diameter 1, hole 0.6, Top Layer to Bottom Layer, 9 vias
v2: diameter 0.61, hole 0.305, Top Layer to Bottom Layer, 82 vias
v3: diameter 1.2, hole 0.7, Top Layer to Bottom Layer, 2 vias

## Routing (per net, layer and track width the routed paths; a pad name or vN(x,y) marks a point on that pad's centre or on a via; arc(x,y) is an arc through that point)
24VIN: length 83.8
  Top Layer w0.254: 46.28,24.78 46.3,24.76
  Top Layer w0.68: 45.34,28.61 45.23,28.5 43.91,28.5 C24.1 ; 45.34,28.61 45.34,29.37 44.06,30.64 36.84,30.64 35.88,29.69 35.88,29.49 35.85,29.46 36.45,28.86 36.45,27.08 40.89,22.64 ; 45.34,28.61 v1(45.34,28.48) ; 40.89,22.64 41.6,21.93 U12.4 ; 40.89,22.64 v1(40.89,18.68) ; 46.3,19.76 v1(46.3,18.68) ; 46.3,24.76 v1(46.3,25.74)
  Top Layer w0.8: U19.2 20.99,27.86 15.98,27.86 14.86,28.99 v1(14.48,28.99)
  Top Layer w0.85: v1(35.18,29.75) 35.62,29.75 35.88,29.49
  Top Layer w1: C29.2 v1(5.44,24.8) C30.2 ; v1(14.48,28.99) 13.91,28.99 13.02,28.1
  Bottom Layer w0.68: v1(46.3,18.68) v1(40.89,18.68) ; v1(45.34,28.48) 46.3,27.52 v1(46.3,25.74)
  Bottom Layer w2: v1(5.44,24.8) 9.63,28.99 v1(14.48,28.99) 15.87,28.99 17.18,30.29 33.75,30.29 34.29,29.75 v1(35.18,29.75)
+3.3V: length 133.2
  Top Layer w0.254: v2(12.32,16.63) 12.32,17.04 12.97,17.69 U16.6 ; R21.2 19.09,13.87 v2(20.54,15.33) 20.58,15.37 R9.2 R8.2 ; 37.21,23.57 v1(37.21,23.67)
  Top Layer w0.5: U12.18 48.47,25.66 C23.2 49.91,26.31 R30.2 52.46,28.86 56.13,28.86 57.91,27.08 57.91,24.87 v2(61.47,21.32) 61.47,25.81 62.87,27.21 69.34,27.21 71.45,29.32
  Top Layer w1: D7.1 38.75,22.13 v1(37.21,23.67)
  Top Layer w1.1: v1(71.37,27.72) 71.45,27.79 71.45,30.96
  Bottom Layer w0.254: 61.47,21.49 63.37,21.49 U13.3 65.24,21.45 R36.1 ; v1(37.21,23.67) 29.98,23.67 29.86,23.54 28.33,23.54 21.42,16.63 13.69,16.63 13.45,16.39 12.97,16.39 12.73,16.63 v2(12.32,16.63) 13.62,15.33 v2(20.54,15.33)
  Bottom Layer w1.1: v1(37.21,23.67) 37.21,24.8 43.81,31.4 69.38,31.4 71.19,29.59 71.19,27.9 v1(71.37,27.72)
+5V: length 57.6
  Top Layer w0.254: USB1.A4B9 7.1,20.08 5.72,18.7 5.72,16.67 7.1,15.28 7.57,15.28 7.79,15.5 9.52,15.5 9.99,15.98 12.49,15.98 12.85,16.33 U16.8 U16.7 13.9,16.98 v2(13.21,16.98) ; 33.02,26.1 v2(33.02,27.21)
  Top Layer w1.68: D2.2 33.65,23.65 32.97,24.33 32.97,25.67
  Bottom Layer w0.254: v2(33.02,27.21) 29.71,23.9 28.19,23.9 21.27,16.99 13.54,16.99 13.53,16.98 v2(13.21,16.98) 16.91,20.68 16.91,22.51 16.5,22.93 15.86,22.93 14.26,24.52 14.17,24.52 5V.1
GND: length 2.8
  Top Layer w0.254: 9.4,23.65 8.52,22.77 6.99,22.77
  vias: v2(5.34,20.58) v2(5.34,15.5) v2(10.04,30.74) v2(22.23,14.37) v2(30.74,20.58) v2(35.82,20.58) v2(50.16,28.86) v2(56.01,36.18) v2(56.14,40.9) v2(60.65,14.94) v2(61.22,40.9) v2(61.22,5.34) v2(61.29,27.62) v2(71.38,25.66) v2(71.38,20.58) v2(71.63,36.1) v2(76.96,13.49) v2(77.85,28.35)
ACT: length 13.3
  Top Layer w0.254: U18.10 v2(61.2,28.61) ; v2(59.05,28.61) 58.16,29.49 55.91,29.49 54.61,30.8 54.61,33.04 R22.2
  Bottom Layer w0.254: v2(61.2,28.61) 61.2,28.61 v2(59.05,28.61)
DTR: length 26.1
  Top Layer w0.254: R2.2 28.29,17.3 Q2.2 26.54,17.3 26.01,17.83 26.01,19.33 26.66,19.97 27.69,19.97 28.07,20.35 28.07,20.98 26.89,22.16 17.29,22.16 16.52,22.93 15.28,22.93 14.35,22 14.35,21.62 14.92,21.05 U16.28
EN: length 100.4
  Top Layer w0.254: v2(23.74,18.06) 22.73,19.08 R8.1 ; v2(24.89,18.83) 24.92,18.85 Q1.3 ; v2(42.67,33.56) 43.28,32.95 EN1.1 40.96,32.29 ; v2(70.18,29.18) 70.18,30.96
  Bottom Layer w0.254: v2(42.67,33.56) 43.18,33.05 69.98,33.05 73.15,29.88 73.15,27.46 72.26,26.57 70.99,26.57 70.18,27.39 v2(70.18,29.18) 69.74,29.62 44.45,29.62 37.59,22.76 28.06,22.76 24.89,19.6 v2(24.89,18.83) 24.13,18.06 v2(23.74,18.06)
GPIO0: length 37.9
  Top Layer w0.254: 56.21,13.56 55.51,12.86 v2(55.25,12.86) ; R9.1 24.85,16.29 Q2.3 26.01,15.26 26.01,14.94 27.58,13.37 39.24,13.37 v2(39.88,12.73) 41.25,12.73 BOOT1.1
  Bottom Layer w0.254: v2(39.88,12.73) 55.12,12.73 v2(55.25,12.86)
LBCKSW1: length 24.1
  Top Layer w0.68: D4.1 52.07,36.04 52.07,33.01 45,25.94 U12.23
  Top Layer w0.75: D4.1 54.9,38.76 L2.1
LBCKSW2: length 23.5
  Top Layer w0.68: L3.1 52.07,9.71 52.07,10.33 51.93,10.33 45,17.26 U12.8
  Top Layer w0.75: D5.1 55.18,6.42 L3.1
LEDCTRL1: length 48.6
  Top Layer w0.254: U12.19 v2(47.6,25.7) ; v2(66.3,15.5) 66.3,13.39 U18.33 ; v2(39.38,15.16) 38.75,14.53 38.75,14.15
  Bottom Layer w0.254: v2(39.38,15.16) 39.71,15.16 41.06,16.52 47.98,16.52 51.05,19.59 51.05,22.26 50.67,22.64 50.23,22.64 49.5,23.38 49.5,23.8 v2(47.6,25.7) 52.82,25.7 56.51,22 56.89,22 56.91,22.02 58.84,22.02 61.4,19.45 62.34,19.45 v2(66.3,15.5)
LEDCTRL2: length 23.3
  Top Layer w0.254: TP7.1 43.69,15.04 ; 43.69,15.04 43.69,14.4 ; 43.69,15.04 v2(43.69,17.1) ; v2(52.71,16.54) 49.49,19.76 U12.12 v2(47.6,17.96) ; v2(56.71,16.53) 58.75,14.49 58.75,13.56
  Bottom Layer w0.254: v2(56.71,16.53) 56.7,16.54 v2(52.71,16.54) ; v2(47.6,17.96) 47.26,17.96 46.38,17.07 43.72,17.07 v2(43.69,17.1)
LEDVCC1: length 7.7
  Top Layer w1.3: C25.1 68.9,38.9 v3(68.6,39.2) 67.79,38.38 L2.2
LEDVCC2: length 6.2
  Top Layer w1.3: C26.1 68.9,6.83 v3(68.6,6.54) 65.66,6.54 L3.2
RSTB: length 39.5
  Top Layer w0.254: v2(34.38,20.42) 33.62,19.65 TP1.1 ; 60.02,13.56 60.02,14.33 56.81,17.54 v2(56.72,17.54) ; U12.13 49.54,20.63 v2(49.95,20.22) 50.04,20.22 v2(52.71,17.56)
  Bottom Layer w0.254: v2(56.72,17.54) 52.72,17.54 v2(52.71,17.56) ; v2(49.95,20.22) 40.26,20.22 36.07,16.03 33.53,16.03 33.15,16.41 33.15,19.18 v2(34.38,20.42)
RTS: length 23.9
  Top Layer w0.254: R3.2 29.58,16.56 28.27,16.56 28.25,16.54 26.16,16.54 23.43,19.27 23.43,20.03 24.16,20.76 Q1.2 25.87,21.8 17.14,21.8 16.97,21.62 16.97,21.06 U16.24
RXD: length 78.9
  Top Layer w0.254: U16.25 16.47,22.13 v2(16.26,22.34) ; 68.91,13.56 v2(68.91,15.9)
  Bottom Layer w0.254: RX.1 11.52,24.17 14.11,24.17 15.94,22.34 v2(16.26,22.34) 16.26,20.85 12.88,17.47 12.34,17.47 11.73,16.87 11.73,16.39 14.33,13.79 51.72,13.79 51.98,14.04 65.95,14.04 67.81,15.9 v2(68.91,15.9)
SPI_CLK: length 43.4
  Top Layer w0.254: U12.16 49.53,22.58 49.56,22.62 49.85,22.62 v2(50.85,23.62) ; v2(37.75,16.12) 38.37,16.75 TP4.1 ; 62.56,13.56 v2(62.56,15.77)
  Bottom Layer w0.254: 51.09,23.62 52.89,23.62 56.91,19.6 57.27,19.6 57.28,19.59 58.74,19.59 v2(62.56,15.77) ; 51.09,23.62 v2(50.85,23.62) ; 51.09,23.62 50.9,23.43 51.77,22.57 51.77,19.29 48.28,15.8 41.35,15.8 39.7,14.14 38.97,14.14 38.35,14.76 38.35,15.52 v2(37.75,16.12)
SPI_CS: length 40.9
  Top Layer w0.254: TP3.1 33.62,17.15 v2(34.38,17.92) ; v2(49.8,22.03) 49.7,21.93 U12.15 ; v2(50.04,16.54) 49.28,17.3 v2(49.28,18.83) ; 61.29,13.56 v2(61.29,15.77)
  Bottom Layer w0.254: v2(50.04,16.54) 50.81,15.77 v2(61.29,15.77) ; v2(34.38,17.92) 38.98,22.51 46.22,22.51 46.71,22.03 v2(49.8,22.03) 49.9,22.13 49.92,22.13 50.54,21.51 50.54,19.98 49.38,18.83 v2(49.28,18.83)
SPI_SDI: length 57.7
  Top Layer w0.254: v2(34.38,15.16) 33.75,14.53 33.75,14.15 ; v2(50.08,24.41) 50.08,23.82 49.49,23.23 U12.17 ; 71.45,13.56 71.45,14.56 69.34,16.67 66.64,16.67 65.81,15.84 v2(64.41,15.84)
  Bottom Layer w0.254: v2(64.41,15.84) 61.09,19.17 61.09,19.21 59.42,20.87 56.5,20.87 52.94,24.44 50.05,24.44 ; v2(34.38,15.16) 35.85,15.16 37.4,16.71 37.99,16.71 38.8,15.9 38.8,14.92 39.14,14.58 39.63,14.58 41.21,16.16 48.13,16.16 51.41,19.44 51.41,22.4 50.98,22.83 50.98,22.85 50.8,23.03 50.61,23.03 50.08,23.56 v2(50.08,24.41) 50.05,24.44 ; 50.05,24.44 50.04,24.44
SPI_SDO: length 37.8
  Top Layer w0.254: v2(49.95,21.27) 51.44,22.75 R30.1 ; v2(49.95,21.27) 51.79,21.27 v2(52.71,20.35) ; v2(49.95,21.27) 49.94,21.28 U12.14 ; v2(56.46,19.19) 60.46,19.19 63.83,15.83 63.83,13.56 ; v2(39.38,20.42) 38.62,19.65 TP2.1
  Bottom Layer w0.254: v2(39.38,20.42) 40.24,21.27 v2(49.95,21.27) ; v2(52.71,20.35) 53.86,19.19 v2(56.46,19.19)
TEMPDQ: length 15.2
  Top Layer w0.254: 60.02,31.01 v2(60.02,26.17)
  Bottom Layer w0.254: R36.2 65.33,20.18 U13.4 61.78,20.18 60.07,21.89 60.07,26.12 v2(60.02,26.17)
TSC_G1_IO1: length 29.8
  Top Layer w0.254: 63.83,31.01 63.83,31.79 65.05,33.01 T11.1 76.2,31.38 76.2,24.97 76.63,24.54 77.22,24.54 77.47,24.29 77.47,21.17 77.22,20.92 76.4,20.92
TSC_G1_IO2: length 31.7
  Top Layer w0.254: 79.88,21.49 79.81,21.42 FPC1.3 ; v2(76.14,34.82) 74.69,33.36 64.14,33.36 62.56,31.79 62.56,31.01
  Bottom Layer w0.254: v2(79.88,21.42) 79.88,21.59 79.15,22.33 79.15,31.82 v2(76.14,34.82)
TSC_G1_IO3: length 35
  Top Layer w0.254: 74.68,21.91 76.39,21.91 76.4,21.92 ; 58.75,31.01 58.75,31.79 60.68,33.72 71.54,33.72 v2(74.46,36.63)
  Bottom Layer w0.254: v2(74.46,36.63) 74.6,36.49 74.6,21.99 v2(74.68,21.92)
TSC_G1_IO4: length 40.9
  Top Layer w0.254: 79.88,22.4 79.87,22.42 FPC1.5 ; 57.48,31.01 57.48,31.79 59.77,34.08 71.19,34.08 72.77,35.66 v2(72.77,38.44)
  Bottom Layer w0.254: v2(72.77,38.44) 73.47,38.44 79.63,32.29 79.63,22.67 v2(79.88,22.42)
TSC_G1_IO5: length 41.7
  Top Layer w0.254: 56.21,31.01 56.21,32.57 64.31,40.67 71.69,40.67 v2(72.1,40.26) ; v2(73.91,22.79) 76.27,22.79 76.4,22.92
  Bottom Layer w0.254: v2(73.91,22.79) 73.87,22.83 73.87,36.52 72.1,38.29 v2(72.1,40.26)
TSC_G2_IO1: length 46.1
  Top Layer w0.254: v2(77.45,11.56) 77.83,11.56 80.46,14.19 arc(80.55,14.42) 80.65,14.66 80.65,23.14 80.37,23.42 FPC1.7 ; 54.79,26.76 v2(56.44,26.76)
  Bottom Layer w0.254: v2(77.45,11.56) 73.94,11.56 72.54,12.96 72.54,16.52 62.3,26.76 v2(56.44,26.76)
TSC_G2_IO2: length 48.1
  Top Layer w0.254: 54.79,17.87 54.61,17.68 53.49,17.68 53.31,17.5 53.31,13.14 55.75,10.7 73.53,10.7 74.17,10.06 75.04,10.06 v2(75.58,9.53) ; 76.4,23.92 v2(75.18,23.92)
  Bottom Layer w0.254: v2(75.58,9.53) 76.42,9.53 78.03,11.13 78.03,11.31 78.03,11.32 78.03,11.8 78.03,11.8 78.03,21.07 v2(75.18,23.92)
TSC_G2_IO3: length 47.9
  Top Layer w0.254: 54.79,16.6 54.61,16.42 54.61,12.45 56.01,11.05 75.97,11.05 ; T23.1 75.53,7.49 77.22,9.17 77.22,9.81 75.97,11.05 ; 75.97,11.05 75.97,19.67 76.74,20.44 77.24,20.44 77.92,21.12 77.92,24.1 78.23,24.42 FPC1.9
TSC_G2_IO4: length 20.2
  Top Layer w0.254: 57.48,13.61 v2(57.48,11.64)
  Bottom Layer w0.254: v2(57.48,11.64) 67.89,11.64 71.88,7.65 71.88,5.51 v2(71.84,5.46)
TXD: length 75
  Top Layer w0.254: v2(15.37,22.09) 15.97,21.48 U16.26 ; v2(68.06,15.31) 67.64,14.89 67.64,12.78
  Bottom Layer w0.254: TX.1 13.6,22.09 v2(15.37,22.09) 13.24,19.96 11.37,19.96 10.34,18.93 10.34,17.28 14.19,13.43 51.87,13.43 52.12,13.69 66.43,13.69 v2(68.06,15.31)
USBDN: length 9.5
  Top Layer w0.254: USB1.A7 6.85,17.43 6.48,17.81 6.48,18.18 6.74,18.45 7.56,18.45 USB1.B7 9.41,18.43 9.65,18.19 U16.5
USBDP: length 8.9
  Top Layer w0.254: v2(12.83,18.83) 12.96,18.69 U16.4 ; 8.64,17.68 8.64,17.18 8.39,16.93 USB1.B6 ; 8.64,17.68 8.39,17.93 USB1.A6 ; 8.64,17.68 8.71,17.61 v2(11.43,17.61)
  Bottom Layer w0.254: v2(12.83,18.83) 11.61,17.61 v2(11.43,17.61)
VLED1: length 11.8
  Top Layer w0.254: U12.24 44.35,26.09 50.55,32.3 R31.1
VLED2: length 12.3
  Top Layer w0.254: R32.1 44.35,16.27 U12.7
$1N7319: length 6.9
  Top Layer w0.254: C24.2 41.8,23.95 43.17,22.58 U12.3
$1N22135: length 2.9
  Top Layer w0.254: ACT25.2 51.81,30.51 R22.1
$1N22137: length 1.9
  Top Layer w0.254: PWR.2 R21.1
$2N873: length 8.3
  Top Layer w1: U15.2 34.29,28.35 35.43,27.21 35.43,25.56 35.94,25.05 35.94,22.49 35.65,22.19 D7.2
$2N891: length 5.6
  Top Layer w2.54: H2.2 4.38,30.51 6.8,28.1
$2N1118: length 2.1
  Top Layer w0.254: R2.1 28.34,18.86 Q1.1
$2N1121: length 2.1
  Top Layer w0.254: R3.1 28.34,15.4 Q2.1
$2N1251: length 3.1
  Top Layer w0.254: R33.2 9.39,18.93 USB1.A5
$2N1380: length 3.3
  Top Layer w0.254: USB1.B5 9.45,15.93 9.85,16.33 10.22,16.33 R34.2
$2N4816: length 3
  Top Layer w0.254: U19.1 21.91,29.37 23.56,31.02
$2N5057: length 6.2
  Top Layer w0.254: R38.2 R37.1 28.84,25.56 U19.5
$2N5135: length 4
  Top Layer w0.254: R39.2 19.31,24.8 19.94,24.8 20.7,25.56 U19.4
$2N5231: length 21.2
  Top Layer w0.6: 28.91,23.27 30.73,25.09 R37.2 30.73,25.94 29.97,25.94 28.99,24.96 v2(28.49,24.96) ; v2(18.16,26.34) 16.61,24.8 C28.1
  Bottom Layer w0.6: v2(28.49,24.96) 19.54,24.96 v2(18.16,26.34)
$2N5237: length 23.2
  Top Layer w0.254: C27.1 25.58,31.02 U19.8
  Top Layer w0.5: v2(24.38,23.54) 24.39,23.53 25.95,23.53 25.95,28.52 26.8,29.37 U19.8
  Bottom Layer w0.5: v2(17.78,28.84) 16.89,27.95 16.89,25.43 18.79,23.54 v2(24.38,23.54)

## Copper pours and planes (outline as drawn; the poured copper is in the pictures)
GND on Top Layer: -10.69,49.87 92.18,49.87 92.18,-6.9 -10.69,-6.9
GND on Bottom Layer: -10.95,49.61 91.92,49.61 91.92,-7.16 -10.95,-7.16

Small or netless copper shapes (teardrops, artwork), in the pictures only: 206 on Top Layer, 77 on Bottom Layer

## Text on the board
Bottom Silkscreen Layer: GCSE Dimmable LED Lamp / Main Board V0.3 / -Sun Z, Nov 2025 | 24V / GND
Top Silkscreen Layer: Hope This Works... | Fish
